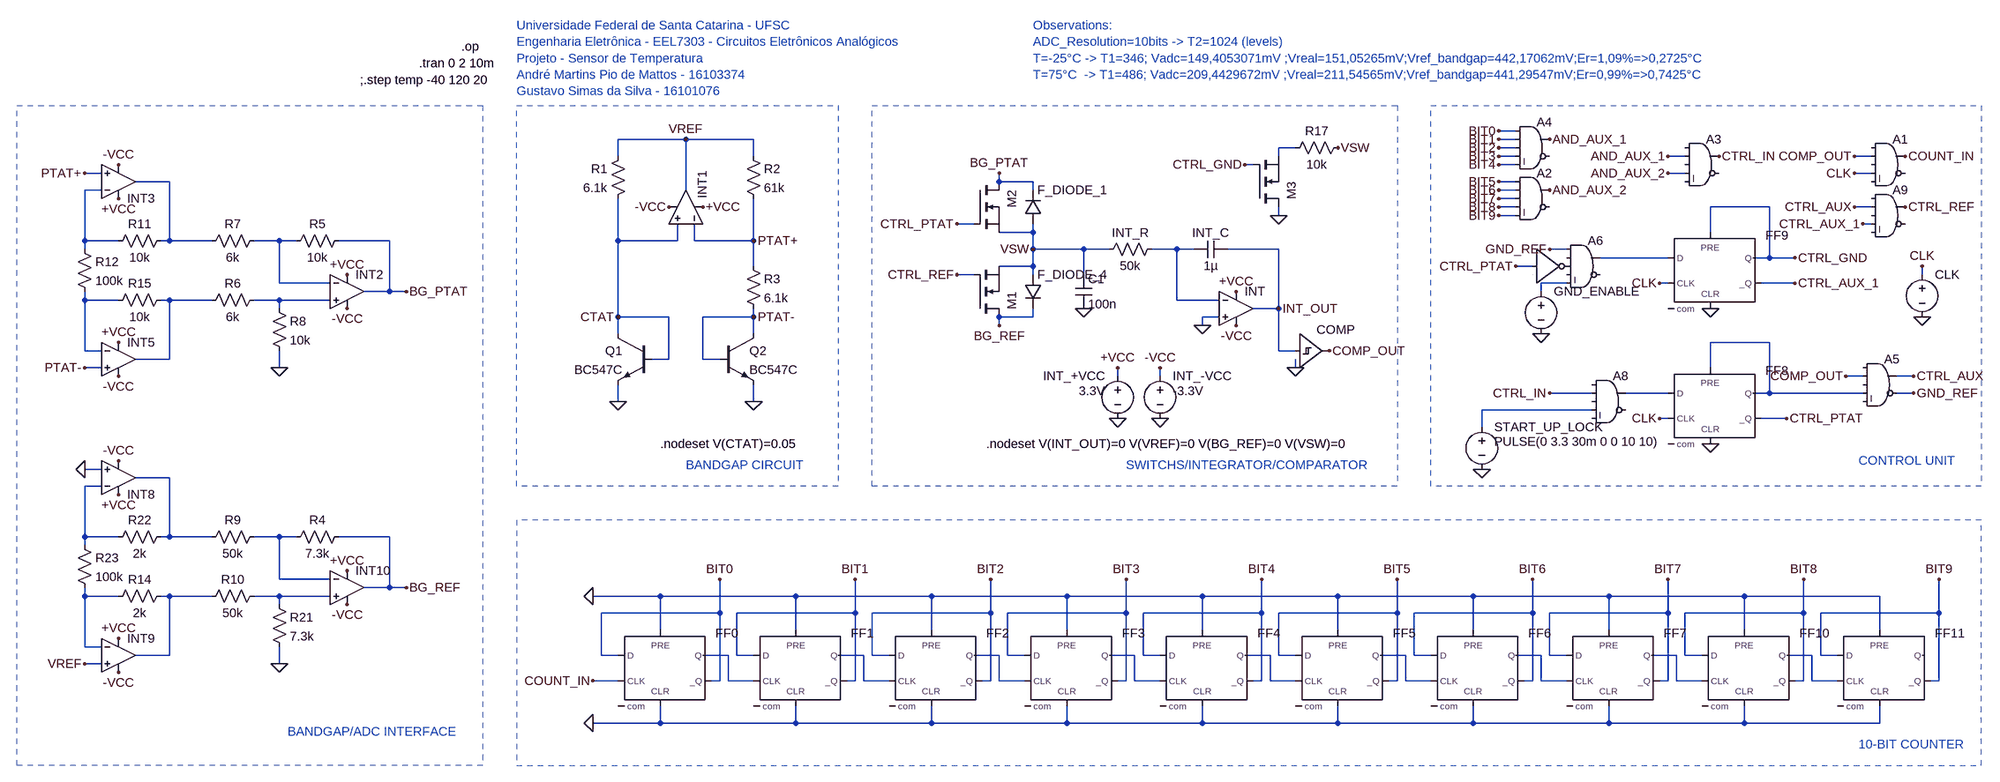
[diagram p0: schematic Temperature_Sensor_Alpha.asc]
Temperature_Sensor_Alpha.asc, the LTspice schematic file:
Version 4
SHEET 1 4048 2092
WIRE 224 -48 192 -48
WIRE -1344 -32 -1472 -32
WIRE -1216 -32 -1344 -32
WIRE 224 -32 192 -32
WIRE -192 -16 -224 -16
WIRE 224 -16 192 -16
WIRE -1472 0 -1472 -32
WIRE -1216 0 -1216 -32
WIRE -224 0 -224 -16
WIRE 224 0 192 0
WIRE 544 0 512 0
WIRE 896 0 864 0
WIRE -272 16 -288 16
WIRE 224 16 192 16
WIRE -2448 32 -2480 32
WIRE 544 32 512 32
WIRE 896 32 864 32
WIRE -2320 48 -2384 48
WIRE -752 48 -752 32
WIRE -688 48 -752 48
WIRE 224 48 192 48
WIRE -2448 64 -2480 64
WIRE -1344 64 -1344 -32
WIRE -688 64 -688 48
WIRE 224 64 192 64
WIRE 224 80 192 80
WIRE 224 96 192 96
WIRE 704 96 592 96
WIRE 896 96 864 96
WIRE -224 112 -224 96
WIRE 224 112 192 112
WIRE -800 128 -832 128
WIRE 896 128 880 128
WIRE -688 144 -688 128
WIRE -688 144 -752 144
WIRE 592 144 592 96
WIRE -2480 160 -2480 64
WIRE -2416 160 -2480 160
WIRE -2320 160 -2320 48
WIRE -2320 160 -2336 160
WIRE -2240 160 -2320 160
WIRE -2112 160 -2160 160
WIRE -2080 160 -2112 160
WIRE -1904 160 -2000 160
WIRE -1472 160 -1472 80
WIRE -1360 160 -1360 128
WIRE -1360 160 -1472 160
WIRE -1328 160 -1328 128
WIRE -1216 160 -1216 80
WIRE -1216 160 -1328 160
WIRE -2480 176 -2480 160
WIRE -688 176 -688 144
WIRE -592 176 -688 176
WIRE -544 176 -592 176
WIRE -416 176 -464 176
WIRE -384 176 -416 176
WIRE -224 176 -320 176
WIRE 320 176 288 176
WIRE 512 192 384 192
WIRE 704 192 704 96
WIRE 704 192 672 192
WIRE 752 192 704 192
WIRE -1216 208 -1216 160
WIRE -688 208 -688 176
WIRE -688 208 -752 208
WIRE 256 208 224 208
WIRE -800 224 -832 224
WIRE -688 224 -688 208
WIRE -592 224 -592 176
WIRE 992 224 992 208
WIRE -2112 240 -2112 160
WIRE -2016 240 -2112 240
WIRE 320 240 272 240
WIRE 512 240 496 240
WIRE 752 240 688 240
WIRE -1904 256 -1904 160
WIRE -1904 256 -1952 256
WIRE -1872 256 -1904 256
WIRE 272 256 272 240
WIRE -2480 272 -2480 256
WIRE -2416 272 -2480 272
WIRE -2320 272 -2336 272
WIRE -2240 272 -2320 272
WIRE -2112 272 -2160 272
WIRE -2016 272 -2112 272
WIRE -416 272 -416 176
WIRE -336 272 -416 272
WIRE -2112 288 -2112 272
WIRE -224 288 -224 176
WIRE -224 288 -272 288
WIRE -1472 304 -1472 160
WIRE -1376 304 -1472 304
WIRE -1216 304 -1216 288
WIRE -1216 304 -1312 304
WIRE -688 304 -688 288
WIRE -688 304 -752 304
WIRE -336 304 -368 304
WIRE -752 320 -752 304
WIRE -368 320 -368 304
WIRE -1472 336 -1472 304
WIRE -1216 336 -1216 304
WIRE 704 352 592 352
WIRE -2480 368 -2480 272
WIRE -2448 368 -2480 368
WIRE -224 368 -224 288
WIRE -192 368 -224 368
WIRE -2320 384 -2320 272
WIRE -2320 384 -2384 384
WIRE -1376 384 -1376 304
WIRE -1376 384 -1408 384
WIRE -1312 384 -1312 304
WIRE -1280 384 -1312 384
WIRE -2448 400 -2480 400
WIRE -2112 400 -2112 368
WIRE -192 400 -192 384
WIRE 592 400 592 352
WIRE -528 416 -528 400
WIRE -448 416 -448 400
WIRE 880 416 848 416
WIRE 976 416 944 416
WIRE 368 448 288 448
WIRE 512 448 432 448
WIRE 704 448 704 352
WIRE 704 448 672 448
WIRE 880 448 704 448
WIRE 976 448 944 448
WIRE -1472 464 -1472 432
WIRE -1216 464 -1216 432
WIRE 368 480 160 480
WIRE 512 496 496 496
WIRE 736 496 688 496
WIRE 160 512 160 480
WIRE -2448 592 -2480 592
WIRE -2320 608 -2384 608
WIRE -2448 624 -2480 624
WIRE -2480 720 -2480 624
WIRE -2416 720 -2480 720
WIRE -2320 720 -2320 608
WIRE -2320 720 -2336 720
WIRE -2240 720 -2320 720
WIRE -2112 720 -2160 720
WIRE -2080 720 -2112 720
WIRE -1904 720 -2000 720
WIRE -2480 736 -2480 720
WIRE -2112 800 -2112 720
WIRE -2016 800 -2112 800
WIRE -1904 816 -1904 720
WIRE -1904 816 -1952 816
WIRE -1872 816 -1904 816
WIRE -2480 832 -2480 816
WIRE -2416 832 -2480 832
WIRE -2320 832 -2336 832
WIRE -2240 832 -2320 832
WIRE -2112 832 -2160 832
WIRE -2016 832 -2112 832
WIRE -1392 832 -1520 832
WIRE -1136 832 -1392 832
WIRE -880 832 -1136 832
WIRE -624 832 -880 832
WIRE -368 832 -624 832
WIRE -112 832 -368 832
WIRE 144 832 -112 832
WIRE 400 832 144 832
WIRE 656 832 400 832
WIRE 912 832 656 832
WIRE -2112 848 -2112 832
WIRE -1280 864 -1280 800
WIRE -1280 864 -1504 864
WIRE -1024 864 -1024 800
WIRE -1024 864 -1248 864
WIRE -768 864 -768 800
WIRE -768 864 -992 864
WIRE -512 864 -512 800
WIRE -512 864 -736 864
WIRE -256 864 -256 800
WIRE -256 864 -480 864
WIRE 0 864 0 800
WIRE 0 864 -224 864
WIRE 256 864 256 800
WIRE 256 864 32 864
WIRE 512 864 512 800
WIRE 512 864 288 864
WIRE 768 864 768 800
WIRE 768 864 544 864
WIRE 1024 864 1024 800
WIRE 1024 864 800 864
WIRE -1392 896 -1392 832
WIRE -1136 896 -1136 832
WIRE -880 896 -880 832
WIRE -624 896 -624 832
WIRE -368 896 -368 832
WIRE -112 896 -112 832
WIRE 144 896 144 832
WIRE 400 896 400 832
WIRE 656 896 656 832
WIRE 912 896 912 832
WIRE -2480 928 -2480 832
WIRE -2448 928 -2480 928
WIRE -2320 944 -2320 832
WIRE -2320 944 -2384 944
WIRE -1504 944 -1504 864
WIRE -1472 944 -1504 944
WIRE -1264 944 -1312 944
WIRE -1248 944 -1248 864
WIRE -1216 944 -1248 944
WIRE -1008 944 -1056 944
WIRE -992 944 -992 864
WIRE -960 944 -992 944
WIRE -752 944 -800 944
WIRE -736 944 -736 864
WIRE -704 944 -736 944
WIRE -496 944 -544 944
WIRE -480 944 -480 864
WIRE -448 944 -480 944
WIRE -240 944 -288 944
WIRE -224 944 -224 864
WIRE -192 944 -224 944
WIRE 16 944 -32 944
WIRE 32 944 32 864
WIRE 64 944 32 944
WIRE 272 944 224 944
WIRE 288 944 288 864
WIRE 320 944 288 944
WIRE 528 944 480 944
WIRE 544 944 544 864
WIRE 576 944 544 944
WIRE 784 944 736 944
WIRE 800 944 800 864
WIRE 832 944 800 944
WIRE -2448 960 -2480 960
WIRE -2112 960 -2112 928
WIRE -1472 992 -1520 992
WIRE -1280 992 -1280 864
WIRE -1280 992 -1296 992
WIRE -1264 992 -1264 944
WIRE -1216 992 -1264 992
WIRE -1024 992 -1024 864
WIRE -1024 992 -1040 992
WIRE -1008 992 -1008 944
WIRE -960 992 -1008 992
WIRE -768 992 -768 864
WIRE -768 992 -784 992
WIRE -752 992 -752 944
WIRE -704 992 -752 992
WIRE -512 992 -512 864
WIRE -512 992 -528 992
WIRE -496 992 -496 944
WIRE -448 992 -496 992
WIRE -256 992 -256 864
WIRE -256 992 -272 992
WIRE -240 992 -240 944
WIRE -192 992 -240 992
WIRE 0 992 0 864
WIRE 0 992 -16 992
WIRE 16 992 16 944
WIRE 64 992 16 992
WIRE 256 992 256 864
WIRE 256 992 240 992
WIRE 272 992 272 944
WIRE 320 992 272 992
WIRE 512 992 512 864
WIRE 512 992 496 992
WIRE 528 992 528 944
WIRE 576 992 528 992
WIRE 768 992 768 864
WIRE 768 992 752 992
WIRE 784 992 784 944
WIRE 832 992 784 992
WIRE 1024 992 1024 864
WIRE 1024 992 1008 992
WIRE -1392 1072 -1392 1040
WIRE -1392 1072 -1520 1072
WIRE -1136 1072 -1136 1040
WIRE -1136 1072 -1392 1072
WIRE -880 1072 -880 1040
WIRE -880 1072 -1136 1072
WIRE -624 1072 -624 1040
WIRE -624 1072 -880 1072
WIRE -368 1072 -368 1040
WIRE -368 1072 -624 1072
WIRE -112 1072 -112 1040
WIRE -112 1072 -368 1072
WIRE 144 1072 144 1040
WIRE 144 1072 -112 1072
WIRE 400 1072 400 1040
WIRE 400 1072 144 1072
WIRE 656 1072 656 1040
WIRE 656 1072 400 1072
WIRE 912 1072 912 1040
WIRE 912 1072 656 1072
FLAG -304 256 +VCC
FLAG -304 320 -VCC
FLAG -192 400 0
FLAG -528 496 0
FLAG -528 400 +VCC
FLAG -448 496 0
FLAG -448 400 -VCC
FLAG -224 288 INT_OUT
FLAG -128 368 COMP_OUT
FLAG -688 176 VSW
FLAG 992 304 0
FLAG 992 208 CLK
FLAG -1520 1072 0
FLAG -1280 800 BIT0
FLAG -1024 800 BIT1
FLAG -768 800 BIT2
FLAG -512 800 BIT3
FLAG -1520 832 0
FLAG 192 -48 BIT0
FLAG 192 -32 BIT1
FLAG 192 -16 BIT2
FLAG 192 0 BIT3
FLAG 288 -32 AND_AUX_1
FLAG -256 800 BIT4
FLAG 0 800 BIT5
FLAG 256 800 BIT6
FLAG 512 800 BIT7
FLAG 864 0 COMP_OUT
FLAG 864 32 CLK
FLAG 960 0 COUNT_IN
FLAG 192 48 BIT5
FLAG 192 64 BIT6
FLAG 192 80 BIT7
FLAG 192 96 BIT8
FLAG 288 64 AND_AUX_2
FLAG 512 0 AND_AUX_1
FLAG 512 32 AND_AUX_2
FLAG 608 0 CTRL_IN
FLAG 592 544 0
FLAG 736 496 CTRL_PTAT
FLAG 496 496 CLK
FLAG 160 592 0
FLAG 288 448 CTRL_IN
FLAG -1520 992 COUNT_IN
FLAG -832 128 CTRL_PTAT
FLAG 848 416 COMP_OUT
FLAG 976 416 CTRL_AUX
FLAG 192 16 BIT4
FLAG 768 800 BIT8
FLAG 1024 800 BIT9
FLAG 192 112 BIT9
FLAG -1472 464 0
FLAG -1216 464 0
FLAG -1312 96 +VCC
FLAG -1376 96 -VCC
FLAG -1344 -32 VREF
FLAG -1216 160 PTAT+
FLAG -1216 304 PTAT-
FLAG -1472 304 CTAT
FLAG -1984 224 +VCC
FLAG -1984 288 -VCC
FLAG -2112 400 0
FLAG -1872 256 BG_PTAT
FLAG -2480 32 PTAT+
FLAG -2480 400 PTAT-
FLAG -752 32 BG_PTAT
FLAG -2480 960 VREF
FLAG -2416 416 -VCC
FLAG -2416 16 -VCC
FLAG -2416 80 +VCC
FLAG -2416 352 +VCC
FLAG -2480 592 0
FLAG -224 112 0
FLAG 976 448 GND_REF
FLAG 288 176 GND_REF
FLAG 272 336 0
FLAG 224 208 CTRL_PTAT
FLAG -368 320 0
FLAG -592 288 0
FLAG -1984 784 +VCC
FLAG -1984 848 -VCC
FLAG -2112 960 0
FLAG -1872 816 BG_REF
FLAG -2416 976 -VCC
FLAG -2416 576 -VCC
FLAG -2416 640 +VCC
FLAG -2416 912 +VCC
FLAG 592 288 0
FLAG 496 240 CLK
FLAG 752 192 CTRL_GND
FLAG 752 240 CTRL_AUX_1
FLAG 880 128 CTRL_AUX_1
FLAG -288 16 CTRL_GND
FLAG 864 96 CTRL_AUX
FLAG 960 96 CTRL_REF
FLAG -752 320 BG_REF
FLAG -832 224 CTRL_REF
FLAG -112 -16 VSW
SYMBOL res -448 160 R90
WINDOW 0 0 56 VBottom 2
WINDOW 3 32 56 VTop 2
SYMATTR InstName INT_R
SYMATTR Value 50k
SYMBOL Digital\\dflop -1392 896 R0
SYMATTR InstName FF0
SYMATTR Value2 Vhigh=3.3 Trise=10u Tfall=10u Td=5u
SYMBOL Digital\\and 256 -80 R0
SYMATTR InstName A4
SYMATTR Value2 Vhigh=3.3 Trise=100n Tfall=100n Vt=0.01
SYMBOL Digital\\schmtbuf -192 304 R0
SYMATTR InstName COMP
SYMATTR Value2 Vhigh=3.3 Trise=3m Tfall=3m Vt=0.01
SYMBOL cap -320 160 R90
WINDOW 0 0 32 VBottom 2
WINDOW 3 32 32 VTop 2
SYMATTR InstName INT_C
SYMATTR Value 1µ
SYMBOL voltage -528 400 M0
WINDOW 3 24 44 Left 2
WINDOW 123 0 0 Left 0
WINDOW 39 24 44 Left 2
SYMATTR Value 3.3V
SYMATTR InstName INT_+VCC
SYMBOL voltage -448 400 R0
WINDOW 3 24 44 Left 2
WINDOW 123 0 0 Left 0
WINDOW 39 24 44 Left 2
SYMATTR Value -3.3V
SYMATTR InstName INT_-VCC
SYMBOL Opamps\\UniversalOpamp2 -304 288 R0
SYMATTR InstName INT
SYMBOL Digital\\dflop -1136 896 R0
SYMATTR InstName FF1
SYMATTR Value2 Vhigh=3.3 Trise=10u Tfall=10u Td=5u
SYMBOL Digital\\dflop -880 896 R0
SYMATTR InstName FF2
SYMATTR Value2 Vhigh=3.3 Trise=10u Tfall=10u Td=5u
SYMBOL Digital\\dflop -624 896 R0
SYMATTR InstName FF3
SYMATTR Value2 Vhigh=3.3 Trise=10u Tfall=10u Td=5u
SYMBOL voltage 992 208 R0
WINDOW 3 24 44 Invisible 2
WINDOW 123 0 0 Left 0
WINDOW 39 24 44 Left 2
SYMATTR Value PULSE(0 3.3 1m 50u 50u 0.5m 1m)
SYMATTR InstName CLK
SYMBOL Digital\\dflop -368 896 R0
SYMATTR InstName FF4
SYMATTR Value2 Vhigh=3.3 Trise=10u Tfall=10u Td=5u
SYMBOL Digital\\dflop -112 896 R0
SYMATTR InstName FF5
SYMATTR Value2 Vhigh=3.3 Trise=10u Tfall=10u Td=5u
SYMBOL Digital\\dflop 144 896 R0
SYMATTR InstName FF6
SYMATTR Value2 Vhigh=3.3 Trise=10u Tfall=10u Td=5u
SYMBOL Digital\\dflop 400 896 R0
SYMATTR InstName FF7
SYMATTR Value2 Vhigh=3.3 Trise=10u Tfall=10u Td=5u
SYMBOL Digital\\and 928 -48 R0
SYMATTR InstName A1
SYMATTR Value2 Vhigh=3.3 Trise=100n Tfall=100n Vt=0.01
SYMBOL Digital\\and 256 16 R0
SYMATTR InstName A2
SYMATTR Value2 Vhigh=3.3 Trise=100n Tfall=100n Vt=0.01
SYMBOL Digital\\and 576 -48 R0
SYMATTR InstName A3
SYMATTR Value2 Vhigh=3.3 Trise=100n Tfall=100n Vt=0.01
SYMBOL Digital\\dflop 592 400 R0
SYMATTR InstName FF8
SYMATTR Value2 Vhigh=3.3 Trise=10u Tfall=10u Td=5u
SYMBOL voltage 160 496 R0
WINDOW 3 24 44 Left 2
WINDOW 123 0 0 Left 0
WINDOW 39 24 44 Left 2
SYMATTR Value PULSE(0 3.3 30m 0 0 10 10)
SYMATTR InstName START_UP_LOCK
SYMBOL Digital\\and 400 400 R0
SYMATTR InstName A8
SYMATTR Value2 Vhigh=3.3 Trise=100n Tfall=100n Vt=0.01
SYMBOL Digital\\and 912 368 R0
SYMATTR InstName A5
SYMATTR Value2 Vhigh=3.3 Trise=100n Tfall=100n Vt=0.01
SYMBOL Digital\\dflop 656 896 R0
SYMATTR InstName FF10
SYMATTR Value2 Vhigh=3.3 Trise=10u Tfall=10u Td=5u
SYMBOL Digital\\dflop 912 896 R0
SYMATTR InstName FF11
SYMATTR Value2 Vhigh=3.3 Trise=10u Tfall=10u Td=5u
SYMBOL npn -1408 336 M0
SYMATTR InstName Q1
SYMATTR Value BC547C
SYMBOL res -1456 -16 M0
SYMATTR InstName R1
SYMATTR Value 6.1k
SYMBOL res -1232 -16 R0
SYMATTR InstName R2
SYMATTR Value 61k
SYMBOL res -1232 192 R0
SYMATTR InstName R3
SYMATTR Value 6.1k
SYMBOL npn -1280 336 R0
SYMATTR InstName Q2
SYMATTR Value BC547C
SYMBOL Opamps\\UniversalOpamp2 -1344 96 M270
SYMATTR InstName INT1
SYMBOL res -1984 144 R90
WINDOW 0 0 56 VBottom 2
WINDOW 3 32 56 VTop 2
SYMATTR InstName R5
SYMATTR Value 10k
SYMBOL res -2144 144 R90
WINDOW 0 0 56 VBottom 2
WINDOW 3 32 56 VTop 2
SYMATTR InstName R7
SYMATTR Value 6k
SYMBOL res -2144 256 R90
WINDOW 0 0 56 VBottom 2
WINDOW 3 32 56 VTop 2
SYMATTR InstName R6
SYMATTR Value 6k
SYMBOL res -2128 272 R0
SYMATTR InstName R8
SYMATTR Value 10k
SYMBOL res -2496 160 R0
SYMATTR InstName R12
SYMATTR Value 100k
SYMBOL Opamps\\UniversalOpamp2 -2416 48 M180
SYMATTR InstName INT3
SYMBOL Opamps\\UniversalOpamp2 -2416 384 R0
SYMATTR InstName INT5
SYMBOL Opamps\\UniversalOpamp2 -1984 256 R0
SYMATTR InstName INT2
SYMBOL nmos -800 48 R0
WINDOW 0 73 50 VLeft 2
WINDOW 3 56 72 Invisible 2
SYMATTR InstName M2
SYMATTR Value IRF6691
SYMBOL nmos -800 304 M180
WINDOW 0 73 14 VRight 2
WINDOW 3 56 72 Invisible 2
SYMATTR InstName M1
SYMATTR Value IRF6691
SYMBOL nmos -272 96 M180
WINDOW 0 73 14 VRight 2
WINDOW 3 56 72 Invisible 2
SYMATTR InstName M3
SYMATTR Value IRF6691
SYMBOL Digital\\and 352 144 R0
SYMATTR InstName A6
SYMATTR Value2 Vhigh=3.3 Trise=100n Tfall=100n Vt=0.01
SYMBOL voltage 272 240 R0
WINDOW 3 24 44 Invisible 2
WINDOW 123 0 0 Left 0
WINDOW 39 0 0 Left 0
SYMATTR Value PULSE(0 3.3 1.024 20m 20m 1 1 1)
SYMATTR InstName GND_ENABLE
SYMBOL Digital\\inv 256 144 R0
WINDOW 0 8 32 Invisible 2
SYMATTR InstName A7
SYMATTR Value2 Vhigh=3.3 Trise=100n Tfall=100n Vt=0.01
SYMBOL res -1984 704 R90
WINDOW 0 0 56 VBottom 2
WINDOW 3 32 56 VTop 2
SYMATTR InstName R4
SYMATTR Value 7.3k
SYMBOL res -2144 704 R90
WINDOW 0 0 56 VBottom 2
WINDOW 3 32 56 VTop 2
SYMATTR InstName R9
SYMATTR Value 50k
SYMBOL res -2144 816 R90
WINDOW 0 0 56 VBottom 2
WINDOW 3 32 56 VTop 2
SYMATTR InstName R10
SYMATTR Value 50k
SYMBOL res -2128 832 R0
SYMATTR InstName R21
SYMATTR Value 7.3k
SYMBOL res -2320 704 R90
WINDOW 0 0 56 VBottom 2
WINDOW 3 32 56 VTop 2
SYMATTR InstName R22
SYMATTR Value 2k
SYMBOL res -2496 720 R0
SYMATTR InstName R23
SYMATTR Value 100k
SYMBOL Opamps\\UniversalOpamp2 -2416 608 M180
SYMATTR InstName INT8
SYMBOL Opamps\\UniversalOpamp2 -2416 944 R0
SYMATTR InstName INT9
SYMBOL Opamps\\UniversalOpamp2 -1984 816 R0
SYMATTR InstName INT10
SYMBOL diode -704 224 R0
WINDOW 3 24 64 Invisible 2
SYMATTR Value 1N4148
SYMATTR InstName F_DIODE_4
SYMBOL res -96 -32 R90
WINDOW 0 0 56 VBottom 2
WINDOW 3 32 56 VTop 2
SYMATTR InstName R17
SYMATTR Value 10k
SYMBOL Digital\\dflop 592 144 R0
SYMATTR InstName FF9
SYMATTR Value2 Vhigh=3.3 Trise=10u Tfall=10u Td=5u
SYMBOL cap -608 224 R0
SYMATTR InstName C1
SYMATTR Value 100n
SYMBOL Digital\\and 928 48 R0
SYMATTR InstName A9
SYMATTR Value2 Vhigh=3.3 Trise=100n Tfall=100n Vt=0.01
SYMBOL diode -704 128 M180
WINDOW 3 24 0 Invisible 2
WINDOW 0 24 64 Left 2
SYMATTR Value 1N4148
SYMATTR InstName F_DIODE_1
SYMBOL res -2320 816 R90
WINDOW 0 0 56 VBottom 2
WINDOW 3 32 56 VTop 2
SYMATTR InstName R14
SYMATTR Value 2k
SYMBOL res -2320 144 R90
WINDOW 0 0 56 VBottom 2
WINDOW 3 32 56 VTop 2
SYMATTR InstName R11
SYMATTR Value 10k
SYMBOL res -2320 256 R90
WINDOW 0 0 56 VBottom 2
WINDOW 3 32 56 VTop 2
SYMATTR InstName R15
SYMATTR Value 10k
TEXT 872 1112 Left 2 ;10-BIT COUNTER
TEXT -512 584 Left 2 ;SWITCHS/INTEGRATOR/COMPARATOR
TEXT 872 576 Left 2 ;CONTROL UNIT
TEXT -1960 -144 Left 2 !;.step temp -40 120 20
TEXT -1344 584 Left 2 ;BANDGAP CIRCUIT
TEXT -2096 1088 Left 2 ;BANDGAP/ADC INTERFACE
TEXT -1664 -248 Left 2 ;Universidade Federal de Santa Catarina - UFSC\nEngenharia Eletrônica - EEL7303 - Circuitos Eletrônicos Analógicos\nProjeto - Sensor de Temperatura\nAndré Martins Pio de Mattos - 16103374\nGustavo Simas da Silva - 16101076
TEXT -1848 -176 Left 2 !.tran 0 2 10m
TEXT -1768 -208 Left 2 !.op
TEXT -688 -248 Left 2 ;Observations:\nADC_Resolution=10bits -> T2=1024 (levels)\nT=-25°C -> T1=346; Vadc=149,4053071mV ;Vreal=151,05265mV;Vref_bandgap=442,17062mV;Er=1,09%=>0,2725°C\nT=75°C  -> T1=486; Vadc=209,4429672mV ;Vreal=211,54565mV;Vref_bandgap=441,29547mV;Er=0,99%=>0,7425°C
TEXT -776 544 Left 2 !.nodeset V(INT_OUT)=0 V(VREF)=0 V(BG_REF)=0 V(VSW)=0
TEXT -1392 544 Left 2 !.nodeset V(CTAT)=0.05
RECTANGLE Normal 1104 624 64 -96 2
RECTANGLE Normal -1664 1152 1104 688 2
RECTANGLE Normal -992 -96 0 624 2
RECTANGLE Normal -1664 -96 -1056 624 2
RECTANGLE Normal -2608 -96 -1728 1152 2

The netlist it stands for:
* Temperature_Sensor_Alpha.asc
R§INT_R N005 VSW 50k
A§FF0 BIT0 0 COUNT_IN 0 0 BIT0 N020 0 DFLOP Vhigh=3.3 Trise=10u Tfall=10u Td=5u
A4 BIT0 BIT1 BIT2 BIT3 BIT4 0 AND_AUX_1 0 AND Vhigh=3.3 Trise=100n Tfall=100n Vt=0.01
A§COMP INT_OUT 0 0 0 0 0 COMP_OUT 0 SCHMITT Vhigh=3.3 Trise=3m Tfall=3m Vt=0.01
C§INT_C INT_OUT N005 1µ
V§INT_+VCC +VCC 0 3.3V
V§INT_-VCC -VCC 0 -3.3V
XINT 0 N005 +VCC -VCC INT_OUT level.2 Avol=1Meg GBW=10Meg Slew=10Meg ilimit=25m rail=0 Vos=0 phimargin=45 en=0 enk=0 in=0 ink=0 Rin=500Meg  ; pins IN+ IN- V+ V- OUT
A§FF1 BIT1 0 N020 0 0 BIT1 N021 0 DFLOP Vhigh=3.3 Trise=10u Tfall=10u Td=5u
A§FF2 BIT2 0 N021 0 0 BIT2 N022 0 DFLOP Vhigh=3.3 Trise=10u Tfall=10u Td=5u
A§FF3 BIT3 0 N022 0 0 BIT3 N023 0 DFLOP Vhigh=3.3 Trise=10u Tfall=10u Td=5u
V§CLK CLK 0 PULSE(0 3.3 1m 50u 50u 0.5m 1m)
A§FF4 BIT4 0 N023 0 0 BIT4 N024 0 DFLOP Vhigh=3.3 Trise=10u Tfall=10u Td=5u
A§FF5 BIT5 0 N024 0 0 BIT5 N025 0 DFLOP Vhigh=3.3 Trise=10u Tfall=10u Td=5u
A§FF6 BIT6 0 N025 0 0 BIT6 N026 0 DFLOP Vhigh=3.3 Trise=10u Tfall=10u Td=5u
A§FF7 BIT7 0 N026 0 0 BIT7 N027 0 DFLOP Vhigh=3.3 Trise=10u Tfall=10u Td=5u
A1 0 COMP_OUT 0 CLK 0 0 COUNT_IN 0 AND Vhigh=3.3 Trise=100n Tfall=100n Vt=0.01
A2 BIT5 BIT6 BIT7 BIT8 BIT9 0 AND_AUX_2 0 AND Vhigh=3.3 Trise=100n Tfall=100n Vt=0.01
A3 0 AND_AUX_1 0 AND_AUX_2 0 0 CTRL_IN 0 AND Vhigh=3.3 Trise=100n Tfall=100n Vt=0.01
A§FF8 N012 0 CLK N011 0 CTRL_PTAT N011 0 DFLOP Vhigh=3.3 Trise=10u Tfall=10u Td=5u
V§START_UP_LOCK N013 0 PULSE(0 3.3 30m 0 0 10 10)
A8 0 CTRL_IN 0 N013 0 0 N012 0 AND Vhigh=3.3 Trise=100n Tfall=100n Vt=0.01
A5 0 COMP_OUT 0 N011 0 GND_REF CTRL_AUX 0 AND Vhigh=3.3 Trise=100n Tfall=100n Vt=0.01
A§FF10 BIT8 0 N027 0 0 BIT8 N028 0 DFLOP Vhigh=3.3 Trise=10u Tfall=10u Td=5u
A§FF11 BIT9 0 N028 0 0 BIT9 0 0 DFLOP Vhigh=3.3 Trise=10u Tfall=10u Td=5u
Q1 CTAT CTAT 0 0 BC547C
R1 VREF CTAT 6.1k
R2 VREF PTAT+ 61k
R3 PTAT+ PTAT- 6.1k
Q2 PTAT- PTAT- 0 0 BC547C
XINT1 CTAT PTAT+ +VCC -VCC VREF level.2 Avol=1Meg GBW=10Meg Slew=10Meg ilimit=25m rail=0 Vos=0 phimargin=45 en=0 enk=0 in=0 ink=0 Rin=500Meg  ; pins IN+ IN- V+ V- OUT
R5 BG_PTAT N004 10k
R7 N004 N002 6k
R6 N010 N009 6k
R8 N010 0 10k
R12 N003 N008 100k
XINT3 PTAT+ N003 +VCC -VCC N002 level.2 Avol=1Meg GBW=10Meg Slew=10Meg ilimit=25m rail=0 Vos=0 phimargin=45 en=0 enk=0 in=0 ink=0 Rin=500Meg  ; pins IN+ IN- V+ V- OUT
XINT5 PTAT- N008 +VCC -VCC N009 level.2 Avol=1Meg GBW=10Meg Slew=10Meg ilimit=25m rail=0 Vos=0 phimargin=45 en=0 enk=0 in=0 ink=0 Rin=500Meg  ; pins IN+ IN- V+ V- OUT
XINT2 N010 N004 +VCC -VCC BG_PTAT level.2 Avol=1Meg GBW=10Meg Slew=10Meg ilimit=25m rail=0 Vos=0 phimargin=45 en=0 enk=0 in=0 ink=0 Rin=500Meg  ; pins IN+ IN- V+ V- OUT
M2 BG_PTAT CTRL_PTAT VSW VSW IRF6691
M1 BG_REF CTRL_REF VSW VSW IRF6691
M3 0 CTRL_GND N001 N001 IRF6691
A6 GND_REF 0 P001 0 N007 0 N006 0 AND Vhigh=3.3 Trise=100n Tfall=100n Vt=0.01
V§GND_ENABLE N007 0 PULSE(0 3.3 1.024 20m 20m 1 1 1)
A7 CTRL_PTAT 0 0 0 0 P001 0 0 BUF Vhigh=3.3 Trise=100n Tfall=100n Vt=0.01
R4 BG_REF N016 7.3k
R9 N016 N014 50k
R10 N019 N018 50k
R21 N019 0 7.3k
R22 N014 N015 2k
R23 N015 N017 100k
XINT8 0 N015 +VCC -VCC N014 level.2 Avol=1Meg GBW=10Meg Slew=10Meg ilimit=25m rail=0 Vos=0 phimargin=45 en=0 enk=0 in=0 ink=0 Rin=500Meg  ; pins IN+ IN- V+ V- OUT
XINT9 VREF N017 +VCC -VCC N018 level.2 Avol=1Meg GBW=10Meg Slew=10Meg ilimit=25m rail=0 Vos=0 phimargin=45 en=0 enk=0 in=0 ink=0 Rin=500Meg  ; pins IN+ IN- V+ V- OUT
XINT10 N019 N016 +VCC -VCC BG_REF level.2 Avol=1Meg GBW=10Meg Slew=10Meg ilimit=25m rail=0 Vos=0 phimargin=45 en=0 enk=0 in=0 ink=0 Rin=500Meg  ; pins IN+ IN- V+ V- OUT
D§F_DIODE_4 VSW BG_REF 1N4148
R17 VSW N001 10k
A§FF9 N006 0 CLK CTRL_GND 0 CTRL_AUX_1 CTRL_GND 0 DFLOP Vhigh=3.3 Trise=10u Tfall=10u Td=5u
C1 VSW 0 100n
A9 0 CTRL_AUX 0 CTRL_AUX_1 0 0 CTRL_REF 0 AND Vhigh=3.3 Trise=100n Tfall=100n Vt=0.01
D§F_DIODE_1 VSW BG_PTAT 1N4148
R14 N018 N017 2k
R11 N002 N003 10k
R15 N009 N008 10k
.model D D
.lib standard.dio
.model NPN NPN
.model PNP PNP
.lib standard.bjt
.model NMOS NMOS
.model PMOS PMOS
.lib standard.mos
* 10-BIT COUNTER
* SWITCHS/INTEGRATOR/COMPARATOR
* CONTROL UNIT
;.step temp -40 120 20
* BANDGAP CIRCUIT
* BANDGAP/ADC INTERFACE
* Universidade Federal de Santa Catarina - UFSC
* Engenharia Eletrônica - EEL7303 - Circuitos Eletrônicos Analógicos
* Projeto - Sensor de Temperatura
* André Martins Pio de Mattos - 16103374
* Gustavo Simas da Silva - 16101076
.tran 0 2 10m
.op
* Observations:
* ADC_Resolution=10bits -> T2=1024 (levels)
* T=-25°C -> T1=346; Vadc=149,4053071mV ;Vreal=151,05265mV;Vref_bandgap=442,17062mV;Er=1,09%=>0,2725°C
* T=75°C  -> T1=486; Vadc=209,4429672mV ;Vreal=211,54565mV;Vref_bandgap=441,29547mV;Er=0,99%=>0,7425°C
.nodeset V(INT_OUT)=0 V(VREF)=0 V(BG_REF)=0 V(VSW)=0
.nodeset V(CTAT)=0.05
.lib UniversalOpamps2.sub
.backanno
.end